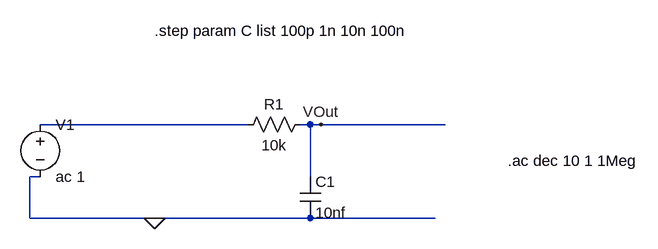
[diagram p0: schematic FirstOrder.asc]
FirstOrder.asc, the LTspice schematic file:
Version 4
SHEET 1 896 680
WIRE 144 160 -176 160
WIRE 240 160 224 160
WIRE 256 160 240 160
WIRE 448 160 256 160
WIRE -176 240 -192 240
WIRE 240 240 240 160
WIRE -192 304 -192 240
WIRE 0 304 -192 304
WIRE 240 304 0 304
WIRE 432 304 240 304
FLAG 0 304 0
FLAG 256 160 VOut
SYMBOL voltage -176 144 R0
WINDOW 123 0 0 Left 0
WINDOW 39 0 0 Left 0
SYMATTR InstName V1
SYMATTR Value ac 1
SYMBOL res 240 144 R90
WINDOW 0 0 56 VBottom 2
WINDOW 3 32 56 VTop 2
SYMATTR InstName R1
SYMATTR Value 10k
SYMBOL cap 224 240 R0
SYMATTR InstName C1
SYMATTR Value 10nf
TEXT 544 216 Left 2 !.ac dec 10 1 1Meg
TEXT 0 16 Left 2 !.step param C list 100p 1n 10n 100n

The netlist it stands for:
* FirstOrder.asc
V1 N001 0 ac 1
R1 VOut N001 10k
C1 VOut 0 10nf
.ac dec 10 1 1Meg
.step param C list 100p 1n 10n 100n
.backanno
.end

* Results of the author's LTspice run, read from the files saved beside the schematic
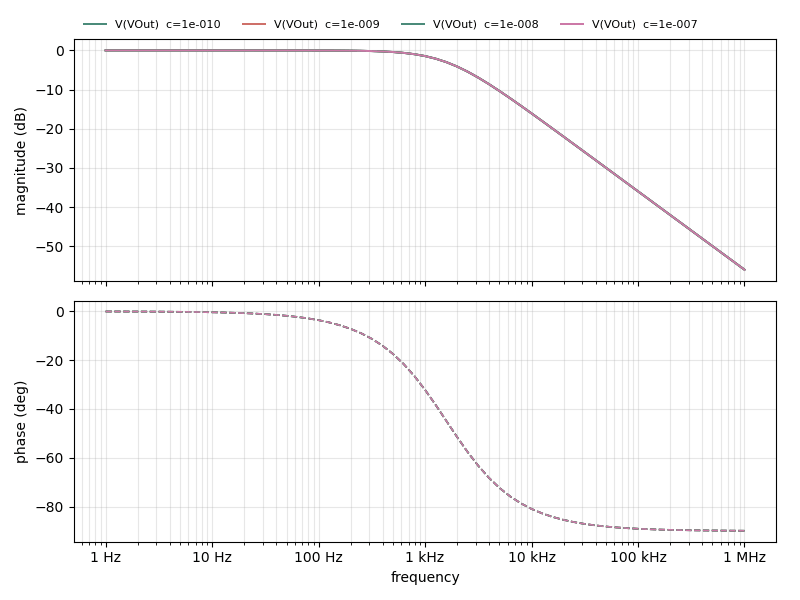
[diagram p1: AC Analysis of FirstOrder.asc, plotted from the saved traces]
* AC Analysis, 4 runs:
*   V(VOut) [c=1e-010]: -0.00 dB at 1 Hz, -55.96 dB at 1 MHz, peak -0.00 dB at 1 Hz, 3 dB below the peak at 1.591 kHz
*   V(VOut) [c=1e-009]: -0.00 dB at 1 Hz, -55.96 dB at 1 MHz, peak -0.00 dB at 1 Hz, 3 dB below the peak at 1.591 kHz
*   V(VOut) [c=1e-008]: -0.00 dB at 1 Hz, -55.96 dB at 1 MHz, peak -0.00 dB at 1 Hz, 3 dB below the peak at 1.591 kHz
*   V(VOut) [c=1e-007]: -0.00 dB at 1 Hz, -55.96 dB at 1 MHz, peak -0.00 dB at 1 Hz, 3 dB below the peak at 1.591 kHz